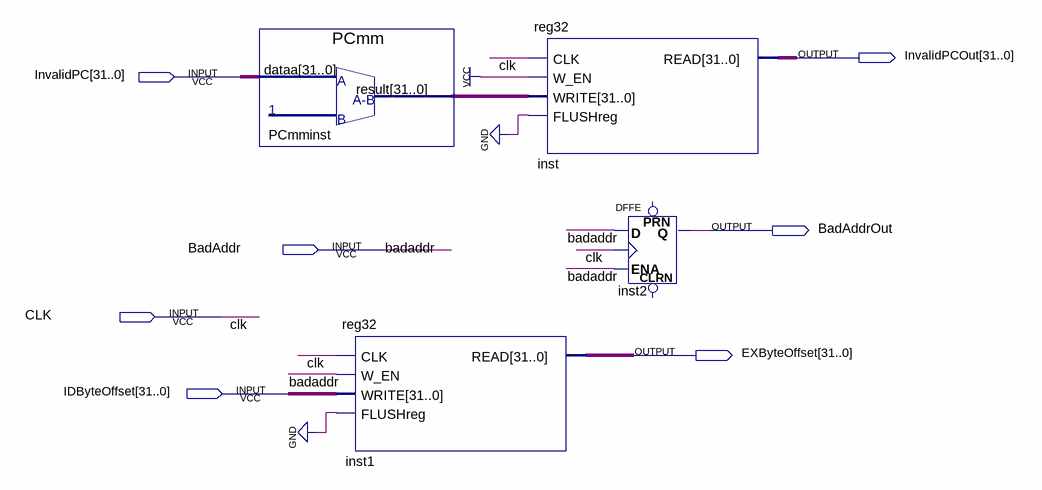
[diagram p0: schematic sheet]
// Quartus schematic ID-EX_MemoryException.bdf as structural Verilog: 4 symbols, 7 pins
module \ID-EX_MemoryException  (
  input  [31:0] InvalidPC,
  input  BadAddr,
  input  CLK,
  input  [31:0] IDByteOffset,
  output [31:0] InvalidPCOut,
  output BadAddrOut,
  output [31:0] EXByteOffset
);

  wire [31:0] PCmminst_result;

  PCmm PCmminst (.dataa(InvalidPC), .result(PCmminst_result));
  reg32 inst1 (.CLK(CLK), .W_EN(BadAddr), .WRITE(IDByteOffset), .FLUSHreg(1'b0), .READ(EXByteOffset));
  reg32 inst (.CLK(CLK), .W_EN(1'b1), .WRITE(PCmminst_result), .FLUSHreg(1'b0), .READ(InvalidPCOut));
  DFFE inst2 (.D(BadAddr), .CLK(CLK), .ENA(BadAddr), .Q(BadAddrOut));  // open: PRN, CLRN
endmodule
